# Altium schematic sheet main_gyro+acc only.SchDoc
size A4; PageSetup: Record=PageOptions|CenterHorizontal=True|CenterVertical=True|PrintScale=0.97|XCorrection=1.00|YCorrection=1.00|PrintKind=2|BorderSize=5000000|LeftOffset=0|BottomOffset=0|Orientation=2|PaperLength=1000|PaperWidth=1000|Scale=100|PaperSource=273|PrintQuality=-2|MediaType=1|DitherType=10|PaperKind=A4|PrintScaleMode=1; Organization: Altium Limited; Address1: 3 Minna Close; Address2: Belrose; Address3: NSW 2085; Address4: Australia
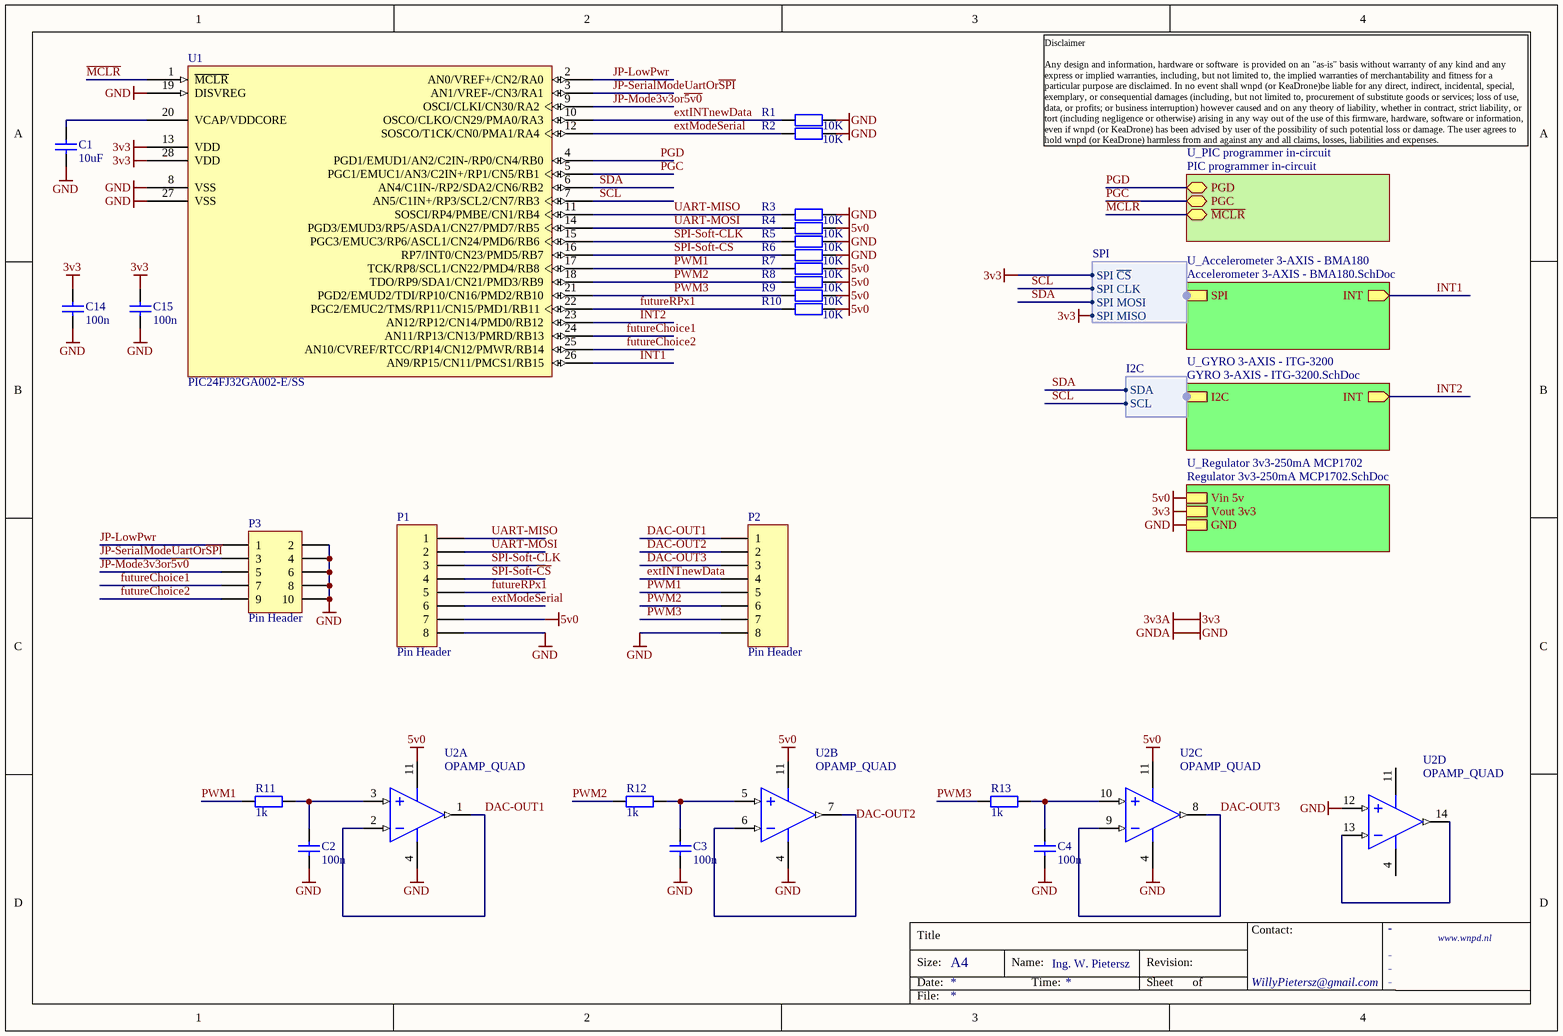
[diagram p0: main_gyro+acc only.SchDoc]

## Parts
C1  10uF  [C1206]
C2  100n  [C0805]
C3  100n  [C0805]
C4  100n  [C0805]
C14  100n  [C0805]
C15  100n  [C0805]
P1  Pin Header  [PH1x8_2.54]
P2  Pin Header  [PH1x8_2.54]
P3  Pin Header  [PH2x5_2.54]
R1  value 10K  [R0805]  (hidden comment: RESISTOR)
R2  value 10K  [R0805]  (hidden comment: RESISTOR)
R3  value 10K  [R0805]  (hidden comment: RESISTOR)
R4  value 10K  [R0805]  (hidden comment: RESISTOR)
R5  value 10K  [R0805]  (hidden comment: RESISTOR)
R6  value 10K  [R0805]  (hidden comment: RESISTOR)
R7  value 10K  [R0805]  (hidden comment: RESISTOR)
R8  value 10K  [R0805]  (hidden comment: RESISTOR)
R9  value 10K  [R0805]  (hidden comment: RESISTOR)
R10  value 10K  [R0805]  (hidden comment: RESISTOR)
R11  value 1k  [R0805]  (hidden comment: RESISTOR)
R12  value 1k  [R0805]  (hidden comment: RESISTOR)
R13  value 1k  [R0805]  (hidden comment: RESISTOR)
U1  PIC24FJ32GA002-E/SS  [SSOP-SS28_N]
U2  OPAMP_QUAD  [SOIC-14]  (parts A,B,C,D of 4)

## Sub-sheets
U_Accelerometer 3-AXIS - BMA180 = Accelerometer 3-AXIS - BMA180.SchDoc: INT (out), SPI (harness SPI)
U_GYRO 3-AXIS - ITG-3200 = GYRO 3-AXIS - ITG-3200.SchDoc: INT (out), I2C (harness I2C)
U_PIC programmer in-circuit = PIC programmer in-circuit: PGD (bidir), PGC (bidir), ~{MCLR} (bidir)
U_Regulator 3v3-250mA MCP1702 = Regulator 3v3-250mA MCP1702.SchDoc: Vin 5v, Vout 3v3, GND

## Harnesses
I2C: SDA, SCL
SPI: SPI ~{CS}, SPI CLK, SPI MOSI, SPI MISO

## Nets
3v3: C14.2 C15.2 U1.13(VDD) U1.28(VDD) ; sheet U_Regulator 3v3-250mA MCP1702/Vout 3v3, sheet U_Accelerometer 3-AXIS - BMA180/SPI.SPI ~{CS}, sheet U_Accelerometer 3-AXIS - BMA180/SPI.SPI MISO  [also labelled 3v3A]
5v0: P1.7 R4.1 R7.1 R8.1 R9.1 R10.1 U2.11(VSS) ; sheet U_Regulator 3v3-250mA MCP1702/Vin 5v
GND: C1.1 C2.1 C3.1 C4.1 C14.1 C15.1 P1.8 P2.8 P3.2 P3.4 P3.6 P3.8 P3.10 R1.1 R2.1 R3.1 R5.1 R6.1 U1.8(VSS) U1.19(DISVREG) U1.27(VSS) U2.4(VDD) U2.12(VIND+) ; sheet U_Regulator 3v3-250mA MCP1702/GND  [also labelled GNDA]
DAC-OUT1: P2.1 U2.1(VOUTA) U2.2(VINA-)
DAC-OUT2: P2.2 U2.6(VINB-) U2.7(VOUTB)
DAC-OUT3: P2.3 U2.8(VOUTC) U2.9(VINC-)
extINTnewData: P2.4 R1.2 U1.10(OSCO/CLKO/CN29/PMA0/RA3)
extModeSerial: P1.6 R2.2 U1.12(SOSCO/T1CK/CN0/PMA1/RA4)
futureChoice1: P3.7 U1.24(AN11/RP13/CN13/PMRD/RB13)
futureChoice2: P3.9 U1.25(AN10/CVREF/RTCC/RP14/CN12/PMWR/RB14)
futureRPx1: P1.5 R10.2 U1.22(PGC2/EMUC2/TMS/RP11/CN15/PMD1/RB11)
INT1: U1.26(AN9/RP15/CN11/PMCS1/RB15) ; sheet U_Accelerometer 3-AXIS - BMA180/INT
INT2: U1.23(AN12/RP12/CN14/PMD0/RB12) ; sheet U_GYRO 3-AXIS - ITG-3200/INT
JP-LowPwr: P3.1 U1.2(AN0/VREF+/CN2/RA0)
JP-Mode3v3or~{5v0}: P3.5 U1.9(OSCI/CLKI/CN30/RA2)
JP-SerialModeUartOr~{SPI}: P3.3 U1.3(AN1/VREF-/CN3/RA1)
~{MCLR}: U1.1(~{MCLR}) ; sheet U_PIC programmer in-circuit/~{MCLR}
PGC: U1.5(PGC1/EMUC1/AN3/C2IN+/RP1/CN5/RB1) ; sheet U_PIC programmer in-circuit/PGC
PGD: U1.4(PGD1/EMUD1/AN2/C2IN-/RP0/CN4/RB0) ; sheet U_PIC programmer in-circuit/PGD
PWM1: P2.5 R7.2 R11.2 U1.17(TCK/RP8/SCL1/CN22/PMD4/RB8)
PWM2: P2.6 R8.2 R12.2 U1.18(TDO/RP9/SDA1/CN21/PMD3/RB9)
PWM3: P2.7 R9.2 R13.2 U1.21(PGD2/EMUD2/TDI/RP10/CN16/PMD2/RB10)
SCL: U1.7(AN5/C1IN+/RP3/SCL2/CN7/RB3) ; sheet U_GYRO 3-AXIS - ITG-3200/I2C.SCL, sheet U_Accelerometer 3-AXIS - BMA180/SPI.SPI CLK
SDA: U1.6(AN4/C1IN-/RP2/SDA2/CN6/RB2) ; sheet U_GYRO 3-AXIS - ITG-3200/I2C.SDA, sheet U_Accelerometer 3-AXIS - BMA180/SPI.SPI MOSI
SPI-Soft-~{CS}: P1.4 R6.2 U1.16(RP7/INT0/CN23/PMD5/RB7)
SPI-Soft-CLK: P1.3 R5.2 U1.15(PGC3/EMUC3/RP6/ASCL1/CN24/PMD6/RB6)
UART-MISO: P1.1 R3.2 U1.11(SOSCI/RP4/PMBE/CN1/RB4)
UART-MOSI: P1.2 R4.2 U1.14(PGD3/EMUD3/RP5/ASDA1/CN27/PMD7/RB5)
NetC1_2: C1.2 U1.20(VCAP/VDDCORE)
NetC2_2: C2.2 R11.1 U2.3(VINA+)
NetC3_2: C3.2 R12.1 U2.5(VINB+)
NetC4_2: C4.2 R13.1 U2.10(VINC+)
NetU2_13: U2.13(VIND-) U2.14(VOUTD)

## Notes on the sheet
- Disclaimer
  Any design and information, hardware or software  is provided on an "as-is" basis without warranty of any kind and any express or implied warranties, including, but not limited to, the implied warranties of merchantability and fitness for a particular purpose are disclaimed. In no event shall wnpd (or KeaDrone)be liable for any direct, indirect, incidental, special, exemplary, or consequential damages (including, but not limited to, procurement of substitute goods or services; loss of use, data, or profits; or business interruption) however caused and on any theory of liability, whether in contract, strict liability, or tort (including negligence or otherwise) arising in any way out of the use of this firmware, hardware, software or information, even if wnpd (or KeaDrone) has been advised by user of the possibility of such potential loss or damage. The user agrees to hold wnpd (or KeaDrone) harmless from and against any and all claims, losses, liabilities and expenses.
- Title
- Size:
- Date:
- A4
- Name:
- Time:
- Ing. W. Pietersz
- Revision:
- Sheet
- of
- WillyPietersz@gmail.com
- Contact:
- -
- www.wnpd.nl
- File:

## Library data of the parts
C1 = 10uF: Voltage: 10V; Type: Ceramic; Tolerance: 0.1; LatestRevision Note: Initial Release; Part Number: 10uF; Value: 10uF; Package: 1206; Component Type: Standard; LatestRevision Date: 14-9-2010; Author: Willem Pietersz; Supplier 1: Farnell; Supplier Part Number 1: 1759434; ComponentLink1Description: Manufacturer; ComponentLink2Description: Datasheet
C2-C4 C14 C15 = 100n: Tolerance: 0.1; LatestRevision Note: Initial Release; Part Number: 100n; Value: 100n; Package: 0805; Component Type: Standard; LatestRevision Date: 31-7-2010; Author: Willy Pietersz; Supplier 1: Farnell; Supplier Part Number 1: 1759266; ComponentLink1Description: Manufacturer; ComponentLink2Description: Datasheet
P1 P2 = PH1x8: Con1x8; Part Number: PH1x8; Pitch: 2.54; LatestRevision Note: Initial Release; Type: Pin Header; Number Of Pins: 8; Component Type: Standard; LatestRevision Date: 23-11-2010; Author: Willy Pietersz; Supplier 1: Farnell
P3 = PH2x5: Header, 5-Pin, Dual row; Part Number: PH2x5; Pitch: 2.54; LatestRevision Note: Initial Release; Type: Pin Header; Number Of Pins: 10; Component Type: Standard; LatestRevision Date: 23-11-2010; Author: Willy Pietersz; Supplier 1: Farnell
R1-R10 = 10K: Manufacturer 1: Panasonic; Manufacturer 1 Part No: ERJT06J103V; Power: 0.25W; Tolerance: 0.05; LatestRevision Note: Initial Release; Published: 8-Jun-2000; LatestRevisionDate: 17-Jul-2002; LatestRevisionNote: Re-released for DXP Platform.; PackageReference: AXIAL-0.4; Publisher: Altium Limited; Part Number: 10K; Type: Film; Package: 0805; Component Type: Standard; LatestRevision Date: 30-7-2010; Author: Willy Pietersz; ROHS: Y; Supplier 1: Farnell; Supplier Part Number 1: 1618242; ComponentLink1Description: Manufacturer; ComponentLink2Description: Datasheet
R11-R13 = 1K: Manufacturer 1: Panasonic; Manufacturer 1 Part No: ERJT06J102V; Power: 0.25W; Tolerance: 0.05; LatestRevision Note: Initial Release; Published: 8-Jun-2000; LatestRevisionDate: 17-Jul-2002; LatestRevisionNote: Re-released for DXP Platform.; PackageReference: AXIAL-0.4; Publisher: Altium Limited; Part Number: 1K; Type: Film; Package: 0805; Component Type: Standard; LatestRevision Date: 30-7-2010; Author: Willy Pietersz; ROHS: Y; Supplier 1: Farnell; Supplier Part Number 1: 1618241; ComponentLink1Description: Manufacturer; ComponentLink2Description: Datasheet
U1 = PIC24FJ32GA002-E/SS: General Purpose 16-Bit Flash Microcontroller, 32KB Flash, 8KB SRAM, 28-Pin SSOP, Extended Temperature; FirstPublished: 2-Dec-2009; DatasheetVersion: revC, Jan-2008; PackageVersion: revBB, Aug-2009; PackageReference: SSOP-SS28; Publisher: Altium Limited; PackageDescription: 28-Lead Plastic Shrink Small Outline (SS) - 5.3mm Body [SSOP]; Supplier 1: Digi-Key; Supplier Part Number 1: PIC24FJ32GA002-E/SS-ND; Supplier 2: Newark; Supplier Part Number 2: 98M1913; Code_JEDEC: MS-150; Code_IPC: SOP65P780-28; ComponentLink1Description: Datasheet; ComponentLink1URL: http://ww1.microchip.com/downloads/en/DeviceDoc/39881c.pdf; ComponentLink2Description: Packaging Specification; ComponentLink2URL: http://www.microchip.com/stellent/groups/techpub_sg/documents/packagingspec/en012702.pdf; ComponentLink3Description: Microchip.com Home; ComponentLink3URL: http://www.microchip.com/
U2 = MCP6244-E/SN: OpAmp; Voltage min: 1.8; Voltage Max: 5.5; Slew rate: 0.3V/uS; Type: RI/RO; Package: SOIC-14; Author: Willem Pietersz; Part Number: MCP6244-E/SN; Supplier 1: Farnell; Supplier Part Number 1: 1439448; ComponentLink1Description: Datasheet; ComponentLink1URL: http://www.farnell.com/datasheets/79114.pdf